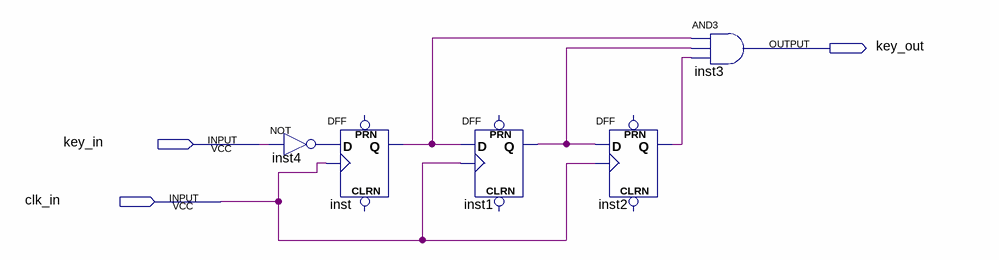
[diagram p0: schematic sheet]
// Quartus schematic key_bi.bdf as structural Verilog: 5 symbols, 3 pins
module key_bi (
  input  key_in,
  input  clk_in,
  output key_out
);

  wire inst1_q, inst2_q, inst4_out, inst_q;

  not inst4 (inst4_out, key_in);
  DFF inst (.CLK(clk_in), .D(inst4_out), .Q(inst_q));  // open: CLRN, PRN
  DFF inst1 (.CLK(clk_in), .D(inst_q), .Q(inst1_q));  // open: CLRN, PRN
  DFF inst2 (.CLK(clk_in), .D(inst1_q), .Q(inst2_q));  // open: CLRN, PRN
  and inst3 (key_out, inst_q, inst1_q, inst2_q);
endmodule
